# Altium schematic sheet LPC1769_Core.SchDoc: Core del LPC1769
size A4; Author: Roux, Federico G.; CompanyName: Universidad Favaloro; DrawnBy: Roux, Federico G.; Engineer: Ing. Craiem, Damian; Organization: Universidad Favaloro; Revision: 1.0; CurrentDate: 10/2013; DocumentName: LPC1769_Core; ProjectName: Pres24
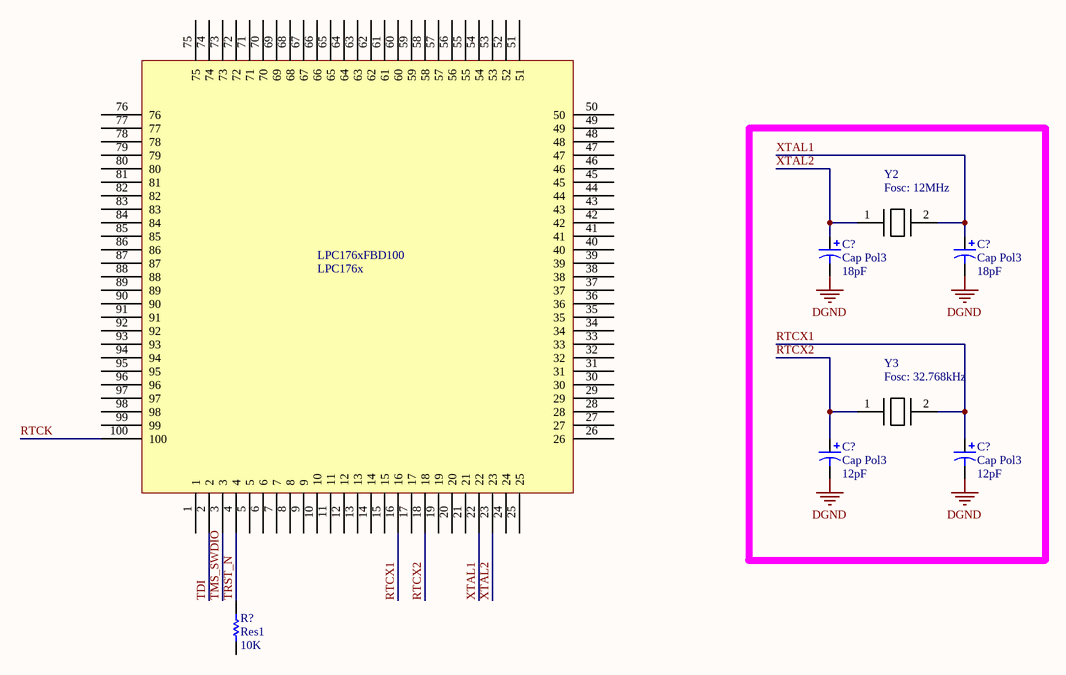
[diagram p0: LPC1769_Core.SchDoc]

## Parts
(Parts that share a designator on the sheet are numbered #1, #2 ... from top to bottom, then left to right.)
C?#1  Cap Pol3  value 18pF  [C0805]
C?#2  Cap Pol3  value 18pF  [C0805]
C?#3  Cap Pol3  value 12pF  [C0805]
C?#4  Cap Pol3  value 12pF  [C0805]
LPC176xFBD100  LPC176x  [SOT407-1_N]
R?  Res1  value 10K  [6-0805_L]
Y2  Fosc: 12MHz  [BCY-W2/E4.7]  (hidden comment: xTAL_2_Terminales)
Y3  Fosc: 32.768kHz  [BCY-W2/D1.5]  (hidden comment: xTAL_2_Terminales)

## Nets
DGND: C?#1.2 C?#2.2 C?#3.2 C?#4.2
RTCK: LPC176xFBD100.100
RTCX1: C?#4.1 LPC176xFBD100.16 Y3.2
RTCX2: C?#3.1 LPC176xFBD100.18 Y3.1
TDI: LPC176xFBD100.2
TMS_SWDIO: LPC176xFBD100.3
TRST_N: LPC176xFBD100.4 R?.2
XTAL1: C?#2.1 LPC176xFBD100.22 Y2.2
XTAL2: C?#1.1 LPC176xFBD100.23 Y2.1

Not connected (* = marked no-connect by the designer): LPC176xFBD100 1 5 6 7 8 9 10 11 12 13 14 15 17 19 20 21 24 25 26 27 28 29 30 31 32 33 34 35 36 37 38 39 40 41 42 43 44 45 46 47 48 49 50 51 52 53 54 55 56 57 58 59 60 61 62 63 64 65 66 67 68 69 70 71 72 73 74 75 76 77 78 79 80 81 82 83 84 85 86 87 88 89 90 91 92 93 94 95 96 97 98 99; R? 1

## Library data of the parts
C?#1-C?#4 = Cap Pol3: Polarized Capacitor (Surface Mount); Published: 8-Jun-2000; LatestRevisionDate: 29-May-2009; LatestRevisionNote: IPC-7351 Footprint Added.; PackageReference: C0805; Publisher: Altium Limited; PackageDescription: Chip Capacitor
R? = Res1: Resistor; Published: 8-Jun-2000; LatestRevisionDate: 17-Jul-2002; LatestRevisionNote: Re-released for DXP Platform.; PackageReference: AXIAL-0.3; Publisher: Altium Limited; PackageDescription: Axial Device, Thru-Hole; 2 Leads; 0.3 in Pin Spacing
Y2 Y3 = xTAL_2_Pines: Oscilador de Cristal 2 Terminales; Autor: ROUX, Federico G. (rouxfederico@gmail.com); Fecha: 05/2011; Empresa: Neróx 2011; Name: xTAL_2_Terminales